# EAGLE schematic Launch-28020 (EAGLE 8.4.0)
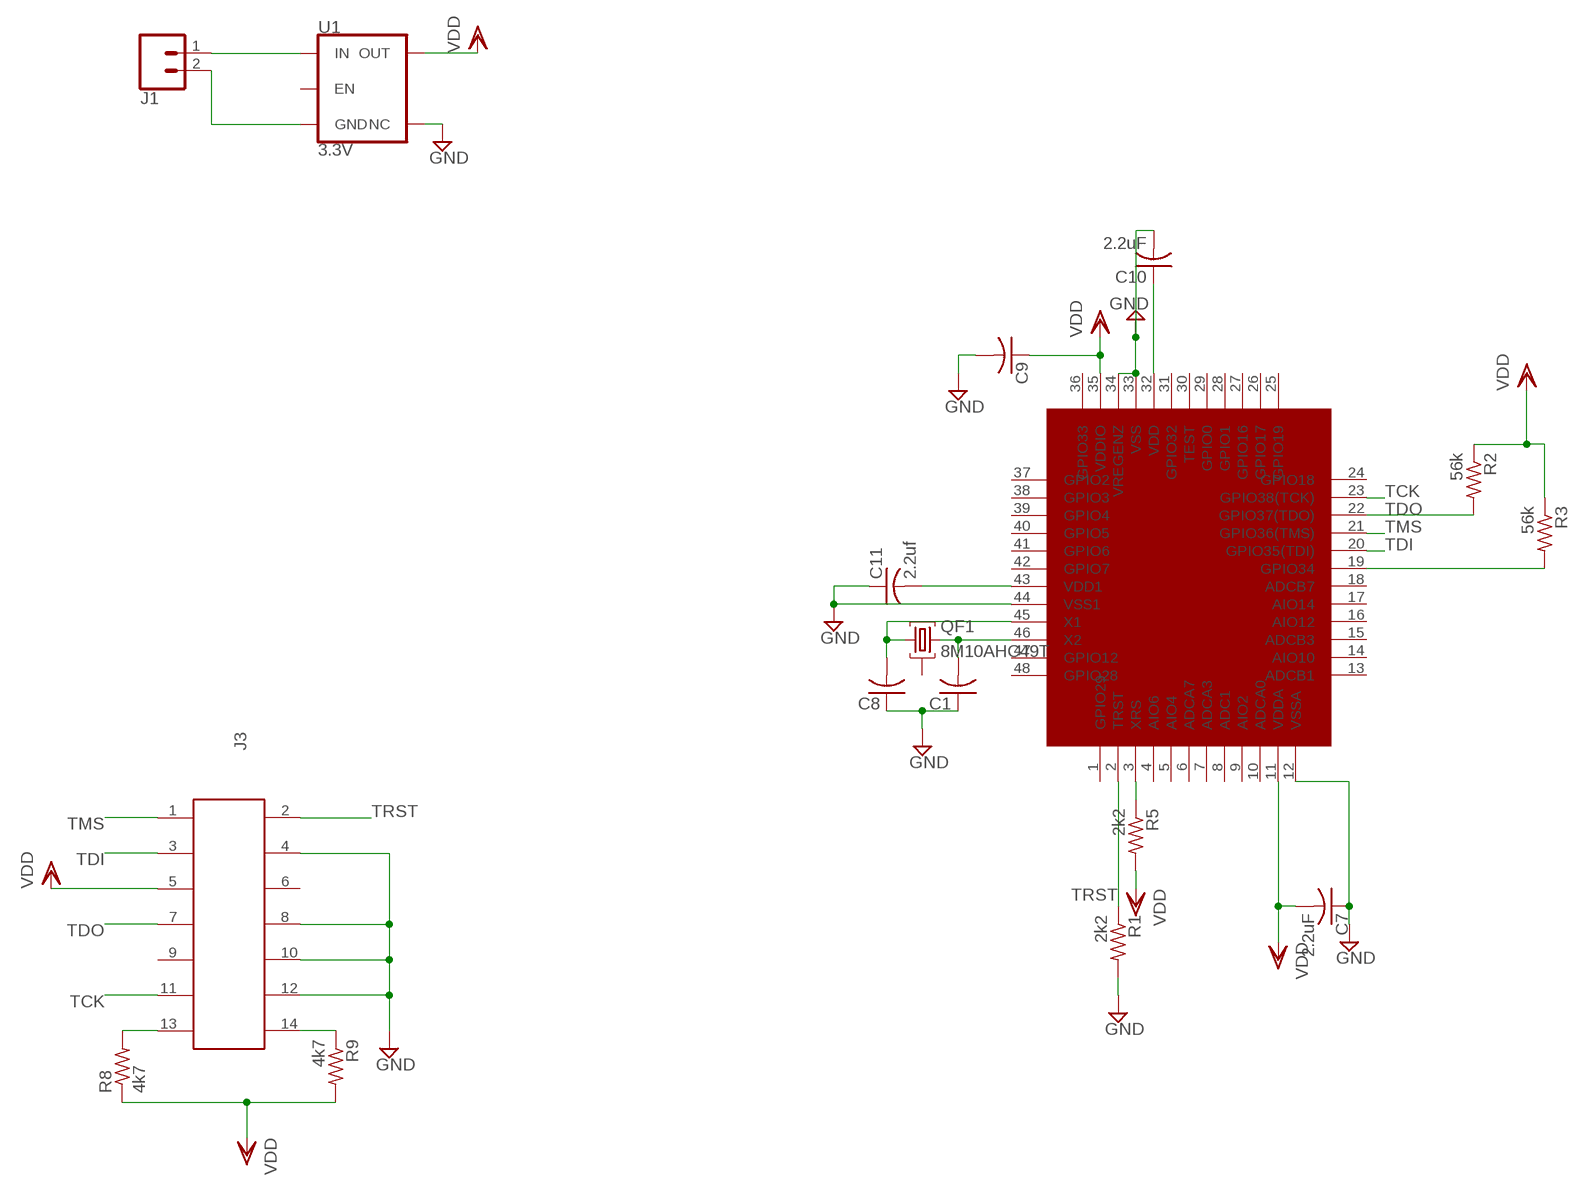
[diagram p0: schematic, sheet 1]

## Parts
C1  C-USC1206  [C1206]
C7  2.2uF  C-USC1206  [C1206]
C8  C-USC1206  [C1206]
C9  C-USC1206  [C1206]
C10  2.2uF  C-USC1206  [C1206]
C11  2.2uf  C-USC1206  [C1206]
J1  CONN_023.5MM-NO_SILK  [SCREWTERMINAL-3.5MM-2-NS]
J3  61201422323  [61201422323]
QF1  8M10AHC49T  [HC49U]
R1  2k2  R-US_M1206  [M1206]
R2  56k  R-US_M1206  [M1206]
R3  56k  R-US_M1206  [M1206]
R5  2k2  R-US_M1206  [M1206]
R8  4k7  R-US_M1206  [M1206]
R9  4k7  R-US_M1206  [M1206]
U1  3.3V  V_REG_AP2112K-3.3V  [SOT23-5]
U$1  TMS320F28020  [LQFP-48]

## Nets
GND: C1.1 C7.1 C8.1 C9.2 C10.2 C11.1 J3.4 J3.8 J3.10 J3.12 R1.2 U1.4(NC) U$1.12(VSSA) U$1.33(VSS) U$1.34(VREGENZ) U$1.44(VSS1)
N$1: J1.1 U1.1(IN)
N$2: J1.2 U1.2(GND)
N$3: C10.1 U$1.32(VDD)
N$4: C11.2 U$1.43(VDD1)
N$5: R5.1 U$1.3(XRS)
N$6: C8.2 QF1.1 U$1.45(X1)
N$7: C1.2 QF1.3 U$1.46(X2)
N$8: J3.14 R9.1
N$9: J3.13 R8.2
N$12: R3.2 U$1.19(GPIO34)
TCK: J3.11 U$1.23(GPIO38(TCK))
TDI: J3.3 U$1.20(GPIO35(TDI))
TDO: J3.7 R2.2 U$1.22(GPIO37(TDO))
TMS: J3.1 U$1.21(GPIO36(TMS))
TRST: J3.2 R1.1 U$1.2(TRST)
VDD: C7.2 C9.1 J3.5 R2.1 R3.1 R5.2 R8.1 R9.2 U1.5(OUT) U$1.11(VDDA) U$1.35(VDDIO)
Unconnected: J3.6 J3.9 QF1.2 U1.3(EN) U$1.1(GPIO29) U$1.4(AIO6) U$1.5(AIO4) U$1.6(ADCA7) U$1.7(ADCA3) U$1.8(ADC1) U$1.9(AIO2) U$1.10(ADCA0) U$1.13(ADCB1) U$1.14(AIO10) U$1.15(ADCB3) U$1.16(AIO12) U$1.17(AIO14) U$1.18(ADCB7) U$1.24(GPIO18) U$1.25(GPIO19) U$1.26(GPIO17) U$1.27(GPIO16) U$1.28(GPIO1) U$1.29(GPIO0) U$1.30(TEST) U$1.31(GPIO32) U$1.36(GPIO33) U$1.37(GPIO2) U$1.38(GPIO3) U$1.39(GPIO4) U$1.40(GPIO5) U$1.41(GPIO6) U$1.42(GPIO7) U$1.47(GPIO12) U$1.48(GPIO28)

## Library data of the parts
C1 C7-C11 = rcl:C-US: CAPACITOR, American symbol
J1 = SparkFun-Connectors:CONN_02: Multi connection point. Often used as Generic Header-pin footprint for 0.1 inch spaced/style header connections On any of the 0.1 inch spaced packages, you can populate with these: Break Away Headers - Straight <https://www.sparkfun.com/products/116> (PRT-00116) Break Away Male Headers - Right Angle <https://www.sparkfun.com/products/553> (PRT-00553) Female Headers <https://www.sparkfun.com/products/115> (PRT-00115) Break Away Headers - Machine Pin <https://www.sparkfun.com/products/117> (PRT-00117) Break Away Female Headers - Swiss Machine Pin <https://www.sparkfun.com/products/743> (PRT-00743) For SCREWTERMINALS and SPRING TERMINALS visit here: Screw Terimnals on SparkFun.com <https://www.sparkfun.com/search/results?term=Screw+Terminals> (5mm/3.5mm/2.54mm spacing) This device is also useful as a general connection point to wire up your design to another part of your project. Our various solder wires solder well into these plated through hole pads. Hook-Up Wire - Assortment (Stranded, 22 AWG) <https://www.sparkfun.com/products/11375> (PRT-11375) Hook-Up Wire - Assortment (Solid Core, 22 AWG) <https://www.sparkfun.com/products/11367> (PRT-11367) View the entire wire category on our website here <https://www.sparkfun.com/categories/141> Special notes: Molex polarized connector foot print use with: PRT-08233 with associated crimp pins and housings. 2.54_SCREWTERM for use with PRT-10571. 3.5mm Screw Terminal footprints for PRT-08084 5mm Screw Terminal footprints for use with PRT-08432; PROD_ID: CONN-08399
J3 = Wurth_Elektronik_Electromechanic_Wire_to_Board_Connectors_rev17b:61201422323: WR-BHD 2.54mm Board to Cable Transition Connector, 14 Pins=>Code : Con_WTB_IDC_61201422323 <http://katalog.we-online.de/media/thumbs2/eican/thb_Con_WTB_IDC_6120xx22323_pf2.jpg> Details see: http://katalog.we-online.de/en/em/612_0xx_223_23 Created 2014-06-05, Karrer Zheng 2014 (C) Würth Elektronik
QF1 = crystal:8M10AHC49T: Monolithic Crystal Filters Source: www.vanlong.com; OC_FARNELL: unknown; OC_NEWARK: unknown
R1-R3 R5 R8 R9 = resistor:R-US_: RESISTOR, American symbol
U1 = SparkFun-IC-Power:V_REG_AP2112: AP2112 - 600mA CMOS LDO Regulator w/ Enable The AP2112 is CMOS process low dropout linear regulator with enable function, the regulator delivers a guaranteed 600mA (min.) continuous load current. Features Output Voltage Accuracy: ±1.5% Output Current: 600mA (Min.) Foldback Short Current Protection: 50mA Enable Function to Turn ON/OFF VOUT Low Dropout Voltage (3.3V): 250mV (Typ.) @IOUT=600mA Excellent Load Regulation: 0.2%/A (Typ.) Excellent Line Regulation: 0.02%/V (Typ.) Low Quiescent Current: 55μA (Typ.) Low Standby Current: 0.01μA (Typ.) Low Output Noise: 50μVRMS PSRR: 100Hz -65dB, 1kHz -65dB OTSD Protection Stable with 1.0μF Flexible Cap: Ceramic, Tantalum and Aluminum Electrolytic Operation Temperature Range: -40°C to 85°C ESD: MM 400V, HBM 4000V; PROD_ID: VREG-12457
U$1 = TMS320F28020:TMS320F28020